# EAGLE design PCB-SW-2PB-35-1.1-in-wall-IoT-Switch-Board (EAGLE 7.4.0)
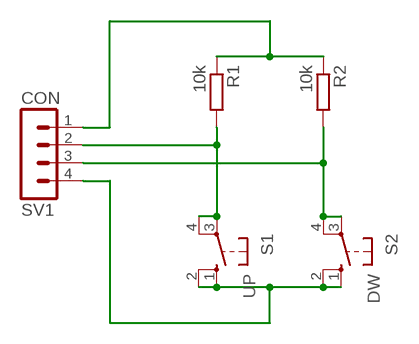
[diagram p0: schematic, sheet 1]

## Parts
R1  10k  R-EU_R1206W  [R1206W]
R2  10k  R-EU_R1206W  [R1206W]
S1  UP  40-XX  [B3F-40XX]
S2  DW  40-XX  [B3F-40XX]
SV1  CON  MA04-1  [MA04-1]

## Nets
N$1: R2.2 S2.3(P) S2.4(P1) SV1.3
N$2: R1.2 S1.3(P) S1.4(P1) SV1.2
N$3: R1.1 R2.1 SV1.1
N$4: S1.1(S) S1.2(S1) S2.1(S) S2.2(S1) SV1.4

## Library data of the parts
R1 R2 = resistor:R-EU_: RESISTOR, European symbol
S1 S2 = switch-omron:40-XX: OMRON SWITCH; MF: OMRON COMPONENTS USA; MPN: B3F-4000; OC_FARNELL: 176434; OC_NEWARK: 36K3105
SV1 = con-lstb:MA04-1: PIN HEADER; OC_FARNELL: unknown; OC_NEWARK: unknown

## Board
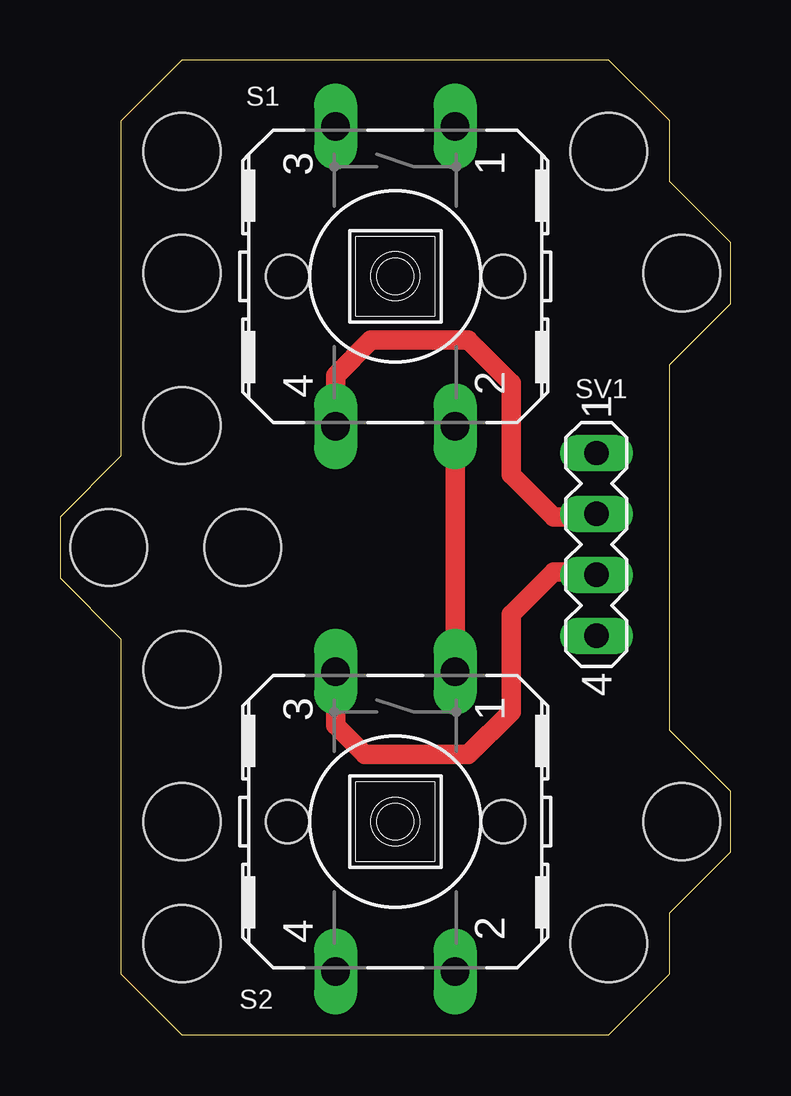
[diagram p1: board, top side]
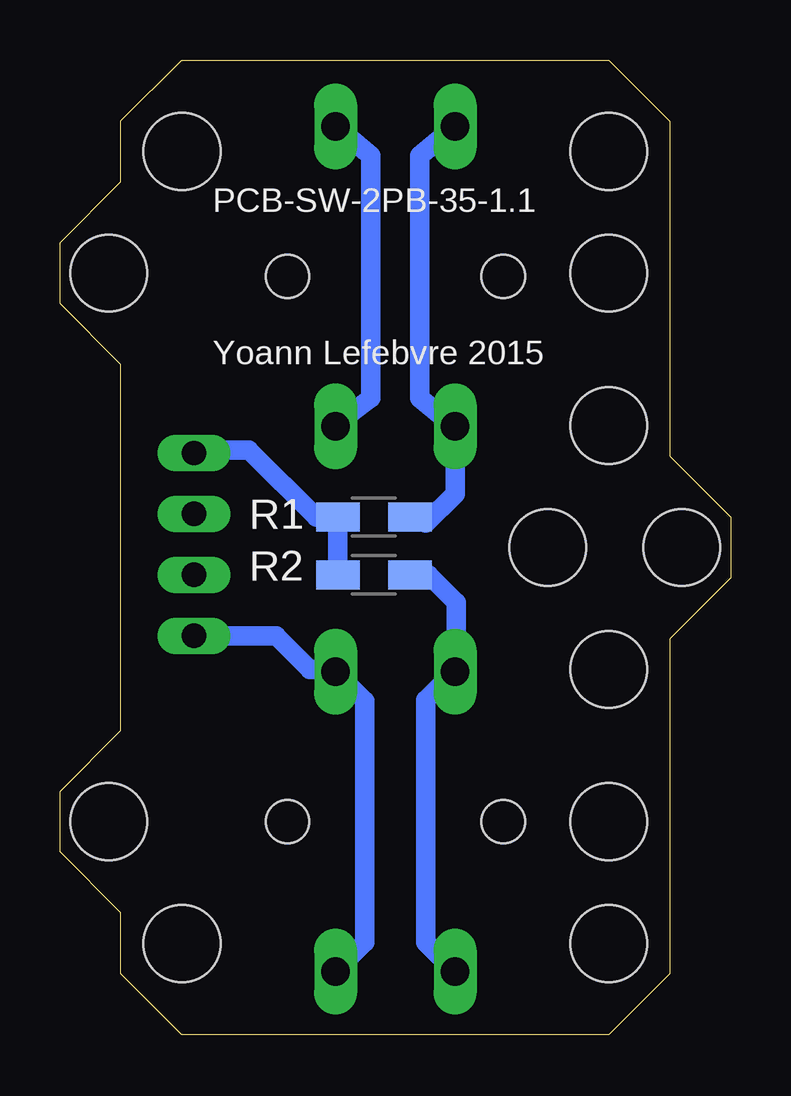
[diagram p2: board, bottom side, seen from below]

Size 27.94 x 40.64 mm. Coordinates in mm from the lower left corner, seen from the top.
Outline: 25.4,35.56 25.4,38.1 22.86,40.64 5.07,40.63 2.54,38.09 2.54,24.13 0,21.59 0,19.05 2.54,16.51 2.54,2.54 5.08,0 22.86,0 25.4,2.54 25.4,5.08 27.94,7.62 27.94,10.16 25.4,12.7 25.4,27.94 27.94,30.48 27.94,33.02 25.4,35.56
Copper layers (1*16): Top 0.035mm / dielectric 1.5mm / Bottom 0.035mm
Design rules "Elecrow_2-layer_eagle_rule": minimum track width 6mil, minimum drill 12mil, track to track 6mil, track to pad 6mil, pad to pad 6mil, via to via 6mil, smd to smd 0mil, copper to edge 10mil, drill to drill 10mil, minimum pad ring 10mil, minimum via ring 6mil, stop-mask expansion 2mil, vias tented up to drill 100mil, thermal gap 10mil
Holes 3.2 mm at 25.91,8.89 25.91,31.75 2.03,20.32 5.08,31.75 5.08,8.89 5.08,36.83 22.86,36.83 22.86,3.81 5.08,3.81 5.08,25.4 5.08,15.24 7.62,20.32

### Footprints (pad centres in the part's own frame; a part is rotated, then mirrored left to right if it is on the bottom)
R1206W = smd 1.8 x 1.2: 1 -1.499,0; 2 1.499,0
B3F-40XX = drill 1.194 long: 1 -6.248,2.489; 2 6.248,2.489; 3 -6.248,-2.489; 4 6.248,-2.489 | hole 1.803: 0,-4.496; 0,4.496
MA04-1 = drill 1.016 long: 1 -3.81,0; 2 -1.27,0; 3 1.27,0; 4 3.81,0

### Placement (x,y rotation side)
R1  14.86,21.59 0 bottom
R2  14.86,19.18 0 bottom
S1  13.97,31.62 270 top
S2  13.97,8.89 270 top
SV1  22.35,20.45 270 top

### Tracks (layer width: path | path; a pad name or v marks a point on that pad's centre or on a via)
N$1
  Top 0.813: SV1.3 22.22,19.3 20.57,19.3 18.8,17.53 18.8,13.46 17.02,11.68 12.7,11.68 11.48,12.9 S2.3
  Bottom 0.813: S2.4 12.7,3.86 12.7,13.97 11.53,15.14 | 11.53,15.14 S2.3 | 11.53,15.14 11.43,15.24 11.43,18.03 12.57,19.18 R2.2
N$2
  Top 0.813: SV1.2 22.22,21.59 20.57,21.59 18.8,23.37 18.8,27.18 17.02,28.96 12.95,28.96 11.48,27.48 S1.4
  Bottom 0.813: S1.3 12.95,36.65 12.95,26.54 11.53,25.38 S1.4 11.48,22.55 12.7,21.34 R1.2
N$3
  Bottom 0.813: R2.1 R1.1 17.27,21.59 20.07,24.38 22.22,24.38 SV1.1
N$4
  Top 0.813: S1.2 S2.1
  Bottom 0.813: S1.1 14.99,36.65 14.99,26.54 16.54,25.38 S1.2 | S2.2 15.24,3.86 15.24,13.92 S2.1 16.56,15.24 17.53,15.24 18.92,16.64 SV1.4

### Text on the board
bNames: PCB-SW-2PB-35-1.1 | Yoann Lefebvre 2015